# Altium schematic sheet [04] - miniPCI.SchDoc
size A3
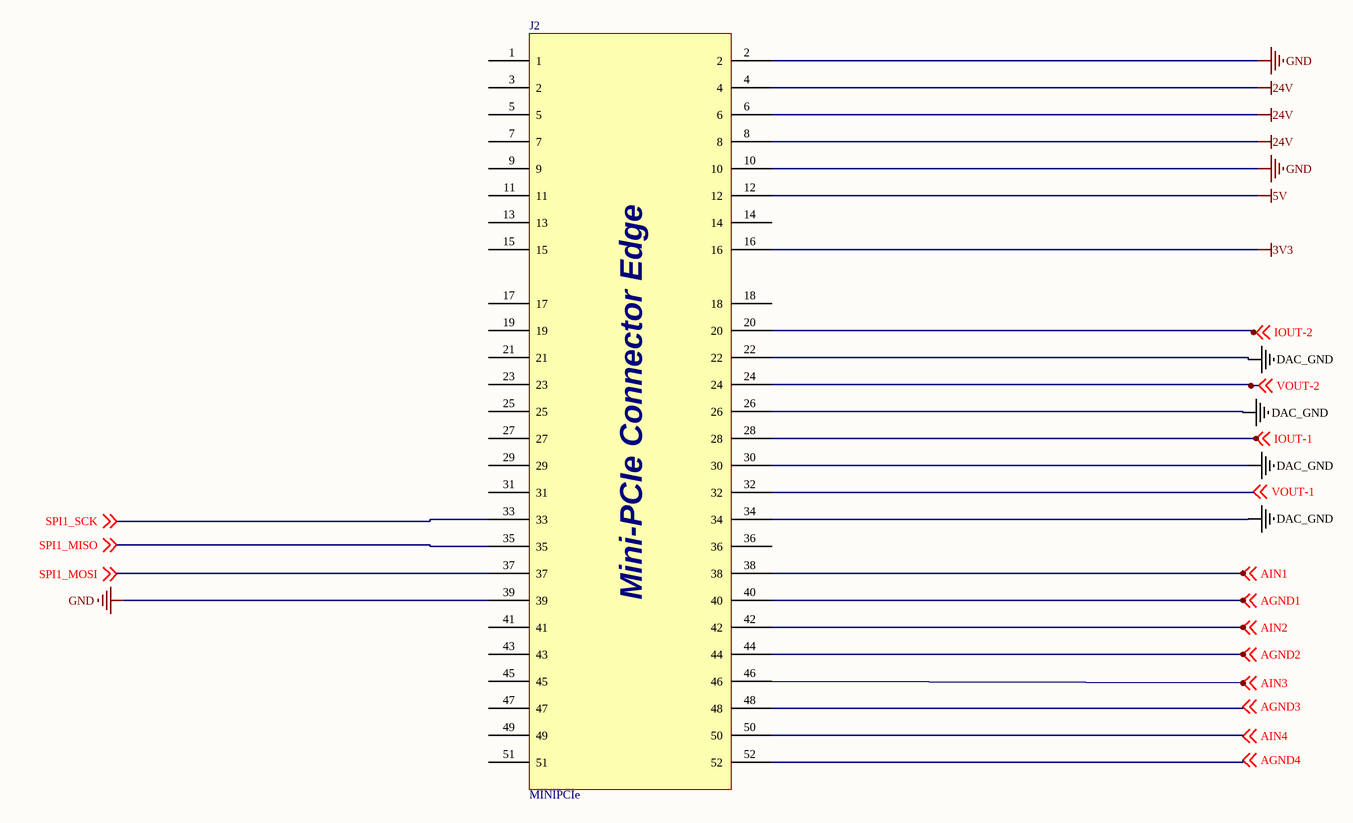
[diagram p0: [04] - miniPCI.SchDoc]

## Parts
J2  MINIPCIe  [MINI PCIe]

## Nets
3V3: J2.16
5V: J2.12
24V: J2.4 J2.6 J2.8
DAC_GND: J2.22 J2.26 J2.30 J2.34
GND: J2.2 J2.10 J2.39
AGND1: J2.40 ; off-sheet AGND1
AGND2: J2.44 ; off-sheet AGND2
AGND3: J2.48 ; off-sheet AGND3
AGND4: J2.52 ; off-sheet AGND4
AIN1: J2.38 ; off-sheet AIN1
AIN2: J2.42 ; off-sheet AIN2
AIN3: J2.46 ; off-sheet AIN3
AIN4: J2.50 ; off-sheet AIN4
IOUT-1: J2.28 ; off-sheet IOUT-1
IOUT-2: J2.20 ; off-sheet IOUT-2
SPI1_MISO: J2.35 ; off-sheet SPI1_MISO
SPI1_MOSI: J2.37 ; off-sheet SPI1_MOSI
SPI1_SCK: J2.33 ; off-sheet SPI1_SCK
VOUT-1: J2.32 ; off-sheet VOUT-1
VOUT-2: J2.24 ; off-sheet VOUT-2

Not connected (* = marked no-connect by the designer): J2 1 3(2) 5 7 9 11 13 14 15 17 18 19 21 23 25 27 29 31 36 41 43 45 47 49 51

## Notes on the sheet
- (in symbol MINIPCIe) Mini-PCIe Connector Edge